# Altium project Beginner_lesson_1.PrjPcb
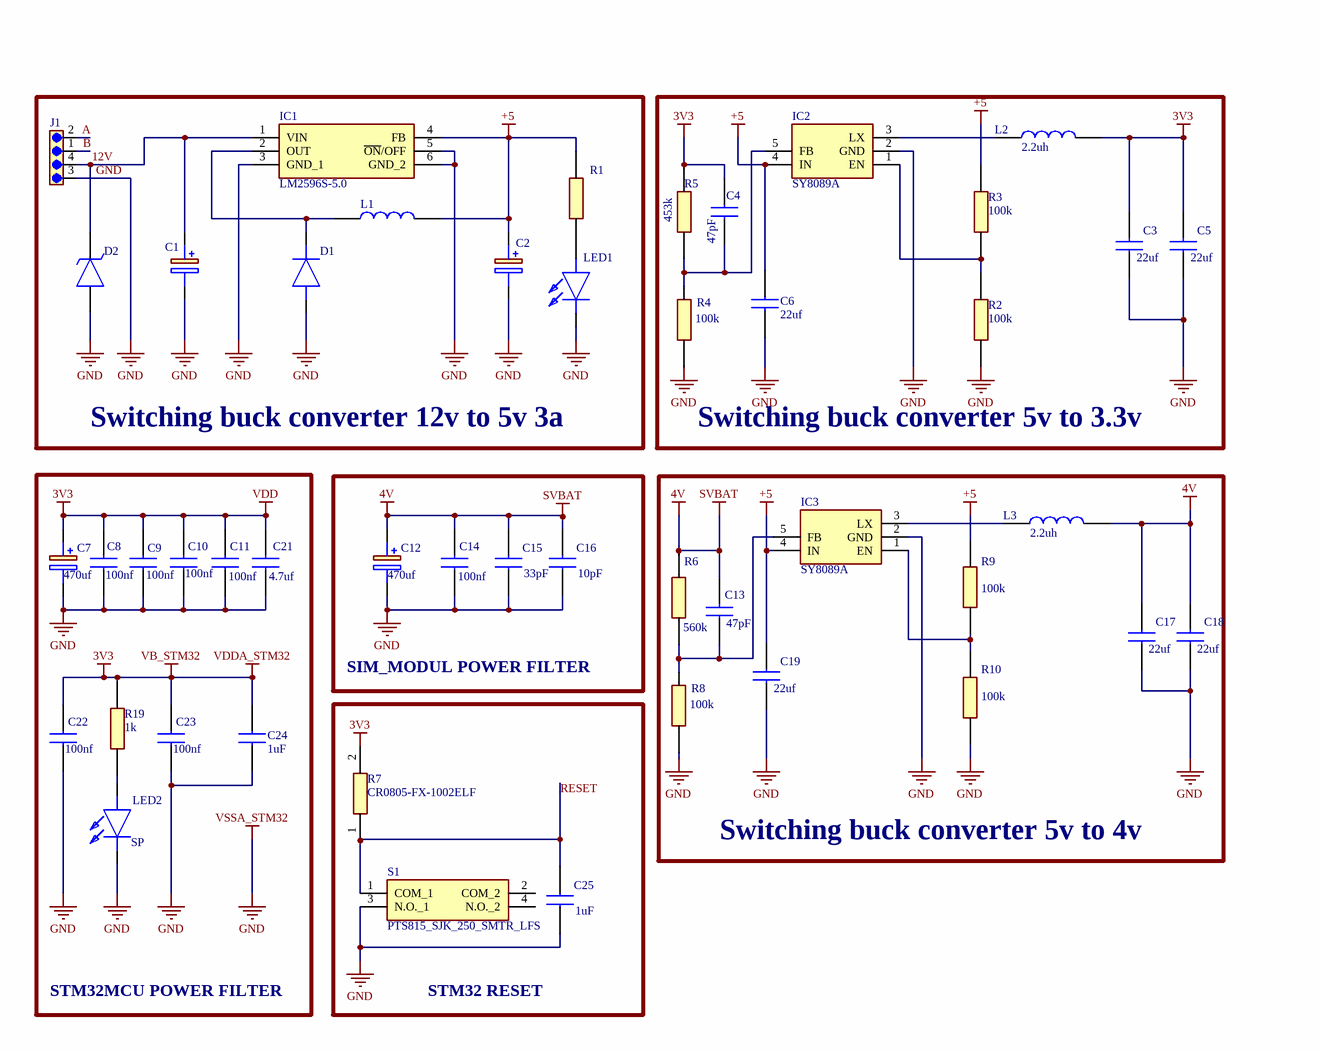
[diagram p0: Schematic.SchDoc, left]
4 sheets, 94 parts. Net scope: global (net labels, ports and power ports of the same name join across sheets).
Board file: PCB_Quectel_M25.PcbDoc
Sheets:
  Schematic.SchDoc
  Sheet1.SchDoc
  Sheet3.SchDoc
  Sheet2.SchDoc

## Sheet Schematic.SchDoc
size A; SheetNumber: 1; SheetTotal: 4

### Parts
C1  B40900B5477M000  [CAPAE1030X1280N]  (value not drawn)
C2  220uf  [CAPPM7344X310N]  (value not drawn)
C3  22uf  [CAPC2012X140N]
C4  47pF  [C0603]
C5  22uf  [CAPC2012X140N]
C6  22uf  [CAPC2012X140N]
C7  470uf  [T495D]
C8  100nf  [CAPC1608X90N]
C9  100nf  [CAPC1608X90N]
C10  100nf  [CAPC1608X90N]
C11  100nf  [CAPC1608X90N]
C12  470uf  [T495D]
C13  47pF  [C0603]
C14  100nf  [CAPC1608X90N]
C15  33pF  [CAPC0603X33N]
C16  10pF  [CAPC1608X90N]
C17  22uf  [CAPC2012X140N]
C18  22uf  [CAPC2012X140N]
C19  22uf  [CAPC2012X140N]
C21  4.7uf  [CAPC2012X152N]
C22  100nf  [CAPC1608X90N]
C23  100nf  [CAPC1608X90N]
C24  1uF  [CAPC1608X90N]
C25  1uF  [CAPC1608X90N]
D1  SS54B  [DIOM5336X244N]  (value not drawn)
D2  ESDA17P50-1U1M  [ESDA17P501U1M]  (value not drawn)
IC1  LM2596S-5.0  [KTT0005B]
IC2  SY8089A  [SOT95P285X140-5N]
IC3  SY8089A  [SOT95P285X140-5N]
J1  691322310004  [691322310004]  (value not drawn)
L1  SRR1260-330M  [SRR1260-150M]  (value not drawn)
L2  2.2uh  [MPLAL50302R2]
L3  2.2uh  [MPLAL50302R2]
LED1  150080GS75000  [LEDM2012X80N]  (value not drawn)
LED2  SP  [LEDC2012X110N]
R1  150R  [RESC2012X65N]  (value not drawn)
R2  100k  [RESC2012X60N]
R3  100k  [RESC2012X60N]
R4  100k  [RESC2012X60N]
R5  453k  [RESC2012X60N]
R6  560k  [RESC2012X65N]
R7  CR0805-FX-1002ELF  [RESC2012X60N]
R8  100k  [RESC2012X60N]
R9  100k  [RESC2012X60N]
R10  100k  [RESC2012X60N]
R19  1k  [RESC1005X40N]
S1  PTS815_SJK_250_SMTR_LFS  [PTS815SJK250SMTRLFS]

### Blocks framed on the sheet
Switching buck converter 12v to 5v 3a: C1 C2 D1 D2 IC1 J1 L1 LED1 R1
Switching buck converter 5v to 3.3v: C3-C6 IC2 L2 R2-R5
STM32MCU POWER FILTER: C7-C11 C21-C24 LED2 R19
SIM_MODUL POWER FILTER: C12 C14-C16
Switching buck converter 5v to 4v: C13 C17-C19 IC3 L3 R6 R8-R10
STM32 RESET: C25 R7 S1

### Nets
4V: C12.1(+) C13.2 C14.2 C15.2 C16.2(C2) C17.2 C18.2 L3.2 R6.2  [also labelled SVBAT]
+5: C2.1(+) C6.2 C19.2 IC1.4(FB) IC2.4(IN) IC3.4(IN) L1.2 R1.2 R3.2 R9.2
GND: C1.2(-) C2.2(-) C3.1 C5.1 C6.1 C7.2(-) C8.1 C9.1 C10.1 C11.1 C12.2(-) C14.1 C15.1 C16.1(C1) C17.1 C18.1 C19.1 C21.1 C22.1 C23.1 C24.1 C25.1 D1.2(A) D2.2(A) IC1.3(GND_1) IC1.5(~{ON}/OFF) IC1.6(GND_2) IC2.2(GND) IC3.2(GND) J1.3 LED1.1(K) LED2.1(K) R2.1 R4.1 R8.1 R10.1 S1.3(N.O._1)  [also labelled VSSA_STM32]
VB_STM32: C3.2 C4.2 C5.2 C7.1(+) C8.2 C9.2 C10.2 C11.2 C21.2 C22.2 C23.2 C24.2 L2.2 R5.2 R7.2 R19.2  [also labelled 3V3, VDD, VDDA_STM32]
12V: C1.1(+) D2.1(K) IC1.1(VIN) J1.4
A: J1.2
B: J1.1
RESET: C25.2 R7.1 S1.1(COM_1)
NetC4_1: C4.1 IC2.5(FB) R4.2 R5.1
NetC13_1: C13.1 IC3.5(FB) R6.1 R8.2
NetD1_1: D1.1(K) IC1.2(OUT) L1.1
NetIC2_1: IC2.1(EN) R2.2 R3.1
NetIC2_3: IC2.3(LX) L2.1
NetIC3_1: IC3.1(EN) R9.1 R10.2
NetIC3_3: IC3.3(LX) L3.1
NetLED1_2: LED1.2(A) R1.1
NetLED2_2: LED2.2(A) R19.1

Not connected (* = marked no-connect by the designer): S1 2(COM_2) 4(N.O._2)

### Library data of the parts
C1 = B40900B5477M000: Capacitor Polarised; Manufacturer_Name: TDK; Datasheet Link: https://product.tdk.com/system/files/dam/doc/product/capacitor/aluminum-electrolytic/hybrid-polymer/data_sheet/20/30/db/aec/b40900.pdf; Height: 12.8mm; Manufacturer_Part_Number: B40900B5477M000; Mouser Part Number: 871-B40900B5477M000; Mouser Price/Stock: https://www.mouser.co.uk/ProductDetail/EPCOS-TDK/B40900B5477M000?qs=sPbYRqrBIVkjJ1xmSzm%2FSw%3D%3D
C2 = TAJD227K010RNJ: Capacitor Polarised 220uf 10v smd tantalum Part Number: TAJD227K010RNJ; Manufacturer_Name: AVX; Datasheet Link: http://datasheets.avx.com/TAJ.pdf; Height: 3.1mm; Manufacturer_Part_Number: TAJD227K010RNJ; Mouser Part Number: 581-TAJD227K010R; Mouser Price/Stock: https://www.mouser.co.uk/ProductDetail/AVX/TAJD227K010RNJ?qs=min0%252Bk%2FlUAadDEgYeVIB%252Bw%3D%3D; Arrow Part Number: TAJD227K010RNJ; Arrow Price/Stock: https://www.arrow.com/en/products/tajd227k010rnj/avx
C3 C5 C6 C17-C19 = CL21X226MQQNNNE: Capacitor; Manufacturer_Name: SAMSUNG; Datasheet Link: https://product.samsungsem.com/part/download.do; Height: 1.4mm; Manufacturer_Part_Number: CL21X226MQQNNNE; Mouser Part Number: N/A; Mouser Price/Stock: https://www.mouser.com/Search/Refine.aspx?Keyword=N%2FA; Arrow Part Number: CL21X226MQQNNNE; Arrow Price/Stock: https://www.arrow.com/en/products/cl21x226mqqnnne/samsung-electro-mechanics
C4 C13 = C0603H470J5GACTU: Capacitor Part Number: C0603H470J5GACTU 47pf 50v 0603; Manufacturer_Name: KEMET; Datasheet Link: https://content.kemet.com/datasheets/KEM_C1001_C0G_200C_SMD.pdf; Height: 0.87mm; Manufacturer_Part_Number: C0603H470J5GACTU; Mouser Part Number: 80-C0603H470J5GACTU; Mouser Price/Stock: https://www.mouser.co.uk/ProductDetail/KEMET/C0603H470J5GACTU?qs=OlC7AqGiEDlBSvW2T4T4RQ%3D%3D
C7 C12 = T495D477K006ATE100: Capacitor Polarised; Manufacturer_Name: KEMET; Datasheet Link: https://content.kemet.com/datasheets/KEM_T2009_T495.pdf; Height: 3.1mm; Manufacturer_Part_Number: T495D477K006ATE100; Mouser Part Number: 80-T495D477K006E100; Mouser Price/Stock: https://www.mouser.co.uk/ProductDetail/KEMET/T495D477K006ATE100?qs=JMiwNnuXh3pQ954ydQHvqQ%3D%3D; Arrow Part Number: T495D477K006ATE100; Arrow Price/Stock: https://www.arrow.com/en/products/t495d477k006ate100/kemet-corporation?region=nac
C8-C11 C14 C22 C23 = 06036C104MAZ2A: Capacitor; Manufacturer_Name: AVX; Datasheet Link: https://componentsearchengine.com/Datasheets/1/06031A100FAT2A.pdf; Height: 0.9mm; Manufacturer_Part_Number: 06036C104MAZ2A; Mouser Part Number: 581-06036C104MAZ2A; Mouser Price/Stock: https://www.mouser.co.uk/ProductDetail/AVX/06036C104MAZ2A?qs=9g9l2Gjnh0s%2FYval7p6%252B1g%3D%3D; Arrow Part Number: 06036C104MAZ2A; Arrow Price/Stock: https://www.arrow.com/en/products/06036c104maz2a/avx
C15 = GJM0335C0J330JB01D: Capacitor; Manufacturer_Name: Murata Electronics; Datasheet Link: https://datasheet.datasheetarchive.com/originals/distributors/Datasheets_SAMA/1b8ebccddda42a85d5d2941bb85cddb2.pdf; Height: 0.33mm; Manufacturer_Part_Number: GJM0335C0J330JB01D; Mouser Part Number: 81-GJM0335C0J330JB1D; Mouser Price/Stock: https://www.mouser.co.uk/ProductDetail/Murata-Electronics/GJM0335C0J330JB01D?qs=563MOeNa05KY2adUKCPfEg%3D%3D; Arrow Part Number: GJM0335C0J330JB01D; Arrow Price/Stock: https://www.arrow.com/en/products/gjm0335c0j330jb01d/murata-manufacturing
C16 = CC0603JRNPO9BN100: Capacitor; Manufacturer_Name: KEMET; Manufacturer_Part_Number: CC0603JRNPO9BN100; Mouser Part Number: 603-C0603JRNPO9BN100; Mouser Price/Stock: https://www.mouser.co.uk/ProductDetail/Yageo/CC0603JRNPO9BN100?qs=vTakOoo5QyIFwFOmdMrXhw%3D%3D; Arrow Part Number: CC0603JRNPO9BN100; Arrow Price/Stock: https://www.arrow.com/en/products/cc0603jrnpo9bn100/yageo
C21 = 08056D475MAT2A: Capacitor; Manufacturer_Name: AVX; Datasheet Link: https://spicat.kyocera-avx.com/product/mlcc/chartview/08056D475MAT2A/DataSheet/X5R; Height: 1.52mm; Manufacturer_Part_Number: 08056D475MAT2A; Mouser Part Number: 581-08056D475M; Mouser Price/Stock: https://www.mouser.com/Search/Refine.aspx?Keyword=581-08056D475M
C24 C25 = 06036C105MAT2A: Capacitor; Manufacturer_Name: AVX; Datasheet Link: https://componentsearchengine.com/Datasheets/1/06031A100FAT2A.pdf; Height: 0.9mm; Manufacturer_Part_Number: 06036C105MAT2A; Mouser Part Number: 581-06036C105MAT2A; Mouser Price/Stock: https://www.mouser.co.uk/ProductDetail/AVX/06036C105MAT2A?qs=1X9trZCrWl0x0jW7AUsrpw%3D%3D; Arrow Part Number: 06036C105MAT2A; Arrow Price/Stock: https://www.arrow.com/en/products/06036c105mat2a/avx
D1 = SS54B: Diode; Manufacturer_Name: HY Electronic; Datasheet Link: https://datasheet.datasheetarchive.com/originals/distributors/Datasheets-3/DSA-43270.pdf; Height: 2.44mm; Manufacturer_Part_Number: SS54B
D2 = ESDA17P50-1U1M: TVS Diode (Uni-directional); Manufacturer_Name: STMicroelectronics; Datasheet Link: http://www.st.com/content/ccc/resource/technical/document/datasheet/group3/21/d7/38/9c/80/7e/49/d0/DM00304840/files/DM00304840.pdf/jcr:content/translations/en.DM00304840.pdf; Height: 0.6mm; Manufacturer_Part_Number: ESDA17P50-1U1M; Mouser Part Number: 511-ESDA17P50-1U1M; Mouser Price/Stock: https://www.mouser.co.uk/ProductDetail/STMicroelectronics/ESDA17P50-1U1M?qs=aVyJF2WnouQ6X0XKPX5Sbg%3D%3D; Arrow Part Number: ESDA17P50-1U1M; Arrow Price/Stock: https://www.arrow.com/en/products/esda17p50-1u1m/stmicroelectronics?region=nac
IC1 = LM2596S-5.0: Integrated Circuit; Manufacturer_Name: Texas Instruments; Datasheet Link: https://www.ti.com/lit/gpn/LM2596; Manufacturer_Part_Number: LM2596S-5.0; Mouser Part Number: 926-LM2596S-50; Mouser Price/Stock: https://www.mouser.co.uk/ProductDetail/Texas-Instruments/LM2596S-5.0?qs=X1J7HmVL2ZGcOr96VNr%252B%2Fw%3D%3D; Arrow Part Number: LM2596S-5.0; Arrow Price/Stock: https://www.arrow.com/en/products/lm2596s-5.0/texas-instruments?region=nac
IC2 IC3 = SY8089A: Integrated Circuit; Manufacturer_Name: Silergy; Datasheet Link: https://datasheet.lcsc.com/szlcsc/SY8089AAAC_C78988.pdf; Height: 1.4mm; Manufacturer_Part_Number: SY8089A
J1 = 691322310004: 4 Position Terminal Block Header, Male Pins, Shrouded (4 Side) 0.150 (3.81mm) 90Â°, Right Angle Through Hole; MF: Wurth Electronics; SnapEDA_Link: https://www.snapeda.com/parts/691322310004/Wurth+Electronics+Inc./view-part/?ref=snap; Package: None; Value: *; MP: 691322310004; Check_prices: https://www.snapeda.com/parts/691322310004/Wurth+Electronics+Inc./view-part/?ref=eda
L1 = SRR1260-330M: Inductor 33uH; Manufacturer_Name: Bourns; Datasheet Link: https://www.bourns.com/docs/Product-Datasheets/SRR1260.pdf; Manufacturer_Part_Number: SRR1260-330M; Mouser Part Number: 652-SRR1260-330M; Mouser Price/Stock: https://www.mouser.co.uk/ProductDetail/Bourns/SRR1260-330M?qs=R2jSSvul3fC3V4%252BTrq0P0w%3D%3D; Arrow Part Number: SRR1260-330M; Arrow Price/Stock: https://www.arrow.com/en/products/srr1260-330m/bourns?region=nac
L2 L3 = MPL-AL5030-2R2: Inductor Part Number :MPL-AL5030-2R2; Manufacturer_Name: Monolithic Power Systems (MPS); Datasheet Link: https://www.monolithicpower.com/en/documentview/productdocument/index/version/2/document_type/Datasheet/lang/en/sku/MPL-AL5030-2R2/document_id/5804; Height: 3.1mm; Manufacturer_Part_Number: MPL-AL5030-2R2; Mouser Part Number: 946-MPL-AL5030-2R2; Mouser Price/Stock: https://www.mouser.co.uk/ProductDetail/Monolithic-Power-Systems-MPS/MPL-AL5030-2R2?qs=sPbYRqrBIVnhOZ%2F5ltO9Lw%3D%3D
LED1 = 150080GS75000: LED; Manufacturer_Name: Wurth Elektronik; Datasheet Link: https://katalog.we-online.com/led/datasheet/150080GS75000.pdf; Height: 0.8mm; Manufacturer_Part_Number: 150080GS75000; Mouser Part Number: 710-150080GS75000; Mouser Price/Stock: https://www.mouser.co.uk/ProductDetail/Wurth-Elektronik/150080GS75000?qs=2kOmHSv6VfQRoTEZVk1mGA%3D%3D
LED2 = SM0805RC: LED; Manufacturer_Name: Bivar; Datasheet Link: https://componentsearchengine.com/Datasheets/1/SM0805RC.pdf; Height: 1.1mm; Manufacturer_Part_Number: SM0805RC; Mouser Part Number: 749-SM0805RC; Mouser Price/Stock: https://www.mouser.co.uk/ProductDetail/Bivar/SM0805RC?qs=jaLxTFIJCivm3JSYe5gHjQ%3D%3D
R1 = RMCF0805FT150R: Resistor 0805 150R 1/4W; Manufacturer_Name: Stackpole Electronics; Datasheet Link: https://cs.seielect.com/catalog/SEI-RMCF_RMCP.pdf; Height: 0.65mm; Manufacturer_Part_Number: RMCF0805FT150R; Mouser Part Number: 708-RMCF0805FT150R; Mouser Price/Stock: https://www.mouser.co.uk/ProductDetail/SEI-Stackpole/RMCF0805FT150R?qs=FESYatJ8odKRN1MTHzs13Q%3D%3D; Arrow Part Number: RMCF0805FT150R; Arrow Price/Stock: https://www.arrow.com/en/products/rmcf0805ft150r/stackpole-electronics?region=nac
R2-R4 R8-R10 = CR0805-FX-1003ELF: Resistor; Manufacturer_Name: Bourns; Datasheet Link: https://www.bourns.com/pdfs/chpreztr.pdf; Height: 0.6mm; Manufacturer_Part_Number: CR0805-FX-1003ELF; Mouser Part Number: 652-CR0805FX-1003ELF; Mouser Price/Stock: https://www.mouser.co.uk/ProductDetail/Bourns/CR0805-FX-1003ELF?qs=tknLyCMIRbPd3RvyRhvkuQ%3D%3D; Arrow Part Number: CR0805-FX-1003ELF; Arrow Price/Stock: https://www.arrow.com/en/products/cr0805-fx-1003elf/bourns?region=nac
R5 = RK73H2ATTD4533F: Resistor 453k 0805 1/4w; Manufacturer_Name: KOA Speer; Datasheet Link: http://www.koaspeer.com/catimages/Products/RK73H/RK73H.pdf; Height: 0.6mm; Manufacturer_Part_Number: RK73H2ATTD4533F; Mouser Part Number: 660-RK73H2ATTD4533F; Mouser Price/Stock: https://www.mouser.com/Search/Refine.aspx?Keyword=660-RK73H2ATTD4533F; Arrow Part Number: RK73H2ATTD4533F; Arrow Price/Stock: https://www.arrow.com/en/products/rk73h2attd4533f/koa-speer-electronics
R6 = CPF0805B560KE: Resistor; Manufacturer_Name: TE Connectivity; Datasheet Link: http://docs-europe.electrocomponents.com/webdocs/13d1/0900766b813d116f.pdf; Height: 0.65mm; Manufacturer_Part_Number: CPF0805B560KE
R7 = CR0805-FX-1002ELF: Resistor; Manufacturer_Name: Bourns; Datasheet Link: https://www.bourns.com/pdfs/chpreztr.pdf; Height: 0.6mm; Manufacturer_Part_Number: CR0805-FX-1002ELF; Mouser Part Number: 652-CR0805FX-1002ELF; Mouser Price/Stock: https://www.mouser.co.uk/ProductDetail/Bourns/CR0805-FX-1002ELF?qs=tknLyCMIRbPr%252BDD0s0nG9g%3D%3D; Arrow Part Number: CR0805-FX-1002ELF; Arrow Price/Stock: https://www.arrow.com/en/products/cr0805-fx-1002elf/bourns?region=nac
R19 = RC0402JR-071KL: Resistor; Manufacturer_Name: KEMET; Datasheet Link: http://www.yageo.com/documents/recent/PYu-RC0402_51_RoHS_L_6_r.pdf; Height: 0.4mm; Manufacturer_Part_Number: RC0402JR-071KL; Mouser Part Number: 603-RC0402JR-071KL; Mouser Price/Stock: https://www.mouser.co.uk/ProductDetail/YAGEO/RC0402JR-071KL?qs=uM1JSSdPjOCtzNbByOhClA%3D%3D; Arrow Part Number: RC0402JR-071KL; Arrow Price/Stock: https://www.arrow.com/en/products/rc0402jr-071kl/yageo?region=europe
S1 = PTS815_SJK_250_SMTR_LFS: Switch; Manufacturer_Name: C & K COMPONENTS; Manufacturer_Part_Number: PTS815 SJK 250 SMTR LFS; Datasheet Link: https://www.mouser.com/datasheet/2/60/pts815-1535658.pdf; Height: 2mm; Mouser Part Number: 611-PTS815SJK250SMTR; Mouser Price/Stock: https://www.mouser.co.uk/ProductDetail/CK/PTS815-SJK-250-SMTR-LFS?qs=ahcBuItHZ3yETpGYMHf%2FgQ%3D%3D; Arrow Part Number: PTS815 SJK 250 SMTR LFS; Arrow Price/Stock: https://www.arrow.com/en/products/pts815-sjk-250-smtr-lfs/ck

## Sheet Sheet1.SchDoc
size A; SheetNumber: 2; SheetTotal: 4
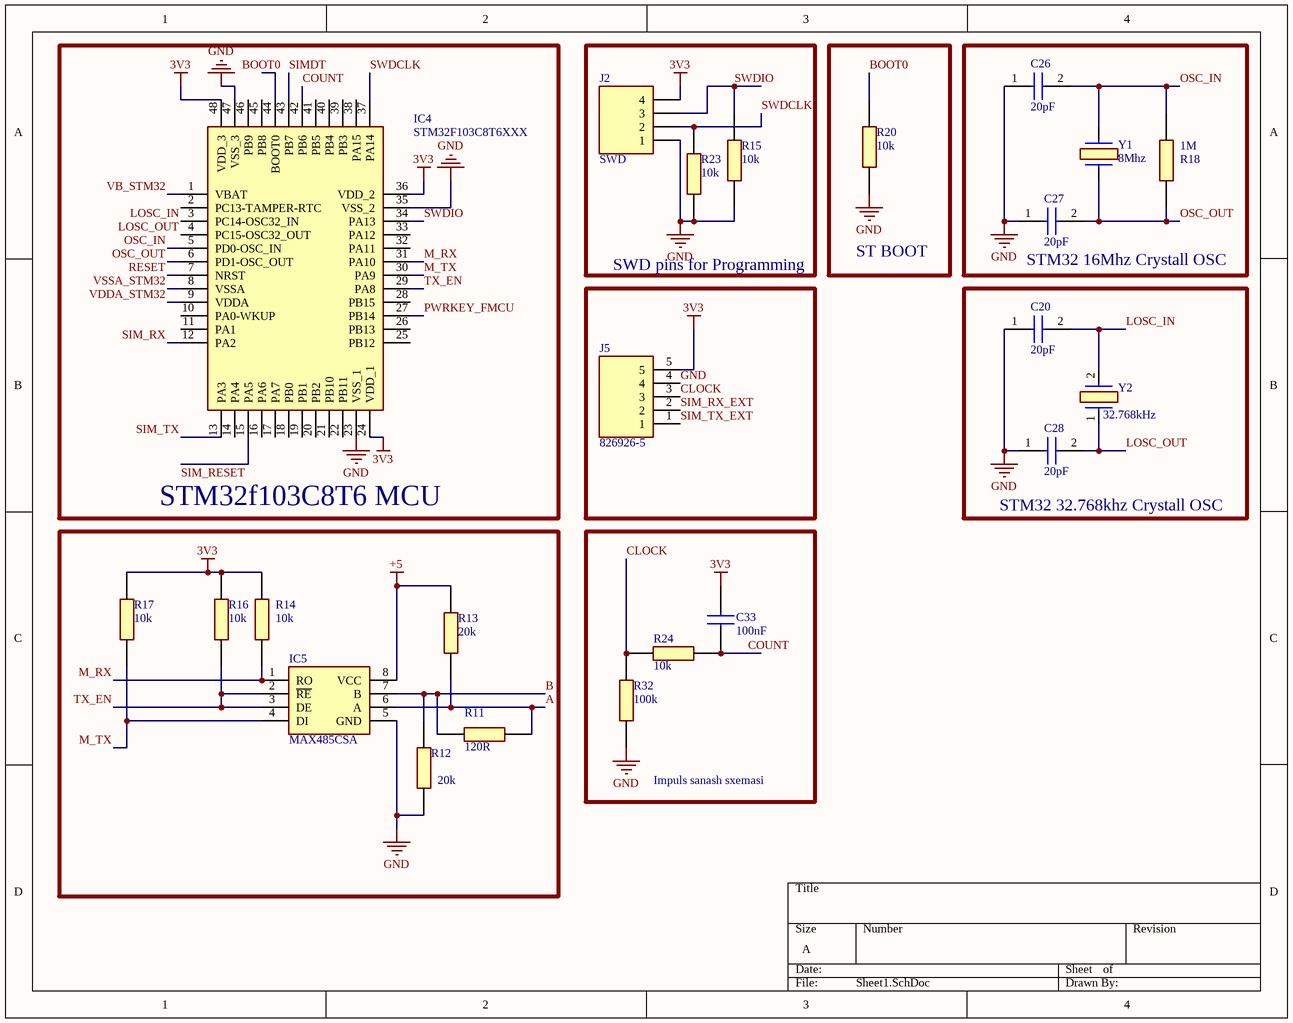
[diagram p1: Sheet1.SchDoc]

### Parts
C20  20pF  [C0603]
C26  20pF  [C0603]
C27  20pF  [C0603]
C28  20pF  [C0603]
C33  100nF  [CAPC1608X90N]
IC4  STM32F103C8T6XXX  [QFP50P900X900X160-48N]
IC5  MAX485CSA  [SOIC127P600X175-8N]
J2  SWD  [9298340704]
J5  826926-5  [HDRV5W85P0X254_1X5_1270X250X950P]
R11  120R  [RESC2012X60N]
R12  20k  [RESC2012X60N]
R13  20k  [RESC2012X60N]
R14  10k  [RESC2012X60N]
R15  10k  [RESC2012X60N]
R16  10k  [RESC2012X60N]
R17  10k  [RESC2012X60N]
R18  1M  [RESC1608X55N]
R20  10k  [RESC2012X60N]
R23  10k  [RESC2012X60N]
R24  10k  [RESC2012X60N]
R32  100k  [RESC2012X60N]
Y1  8Mhz  [830003151]
Y2  32.768kHz  [ABS06]

### Blocks framed on the sheet
SWD pins for Programming: J2 R15 R23
ST BOOT: R20
STM32 16Mhz Crystall OSC: C26 C27 R18 Y1
STM32 32.768khz Crystall OSC: C20 C28 Y2
STM32f103C8T6 MCU: IC5 R11-R14 R16 R17
Impuls sanash sxemasi: C33 R24 R32

### Nets
+5: IC5.8(VCC) R13.2
GND: C20.1 C26.1 C27.1 C28.1 IC4.8(VSSA) IC4.23(VSS_1) IC4.35(VSS_2) IC4.47(VSS_3) IC5.5(GND) J2.1 J5.4 R12.1 R15.1 R20.1 R23.1 R32.1  [also labelled VSSA_STM32]
VB_STM32: C33.2 IC4.1(VBAT) IC4.9(VDDA) IC4.24(VDD_1) IC4.36(VDD_2) IC4.48(VDD_3) J2.4 J5.5 R14.2 R16.2 R17.2  [also labelled 3V3, VDDA_STM32]
A: IC5.6(A) R11.2 R13.1
B: IC5.7(B) R11.1 R12.2
BOOT0: IC4.44(BOOT0) R20.2
CLOCK: J5.3 R24.2 R32.2
COUNT: C33.1 IC4.42(PB6) R24.1
LOSC_IN: C20.2 IC4.3(PC14-OSC32_IN) Y2.2
LOSC_OUT: C28.2 IC4.4(PC15-OSC32_OUT) Y2.1
M_RX: IC4.31(PA10) IC5.1(RO) R14.1
M_TX: IC4.30(PA9) IC5.4(DI) R17.1
OSC_IN: C26.2 IC4.5(PD0-OSC_IN) R18.2 Y1.1
OSC_OUT: C27.2 IC4.6(PD1-OSC_OUT) R18.1 Y1.2
PWRKEY_FMCU: IC4.27(PB14)
RESET: IC4.7(NRST)
SIM_RESET: IC4.15(PA5)
SIM_RX: IC4.12(PA2)
SIM_RX_EXT: J5.2
SIM_TX: IC4.13(PA3)
SIM_TX_EXT: J5.1
SIMDT: IC4.43(PB7)
SWDCLK: IC4.37(PA14) J2.2 R23.2
SWDIO: IC4.34(PA13) J2.3 R15.2
TX_EN: IC4.29(PA8) IC5.2(~{RE}) IC5.3(DE) R16.1

Not connected (* = marked no-connect by the designer): IC4 2(PC13-TAMPER-RTC) 10(PA0-WKUP) 11(PA1) 14(PA4) 16(PA6) 17(PA7) 18(PB0) 19(PB1) 20(PB2) 21(PB10) 22(PB11) 25(PB12) 26(PB13) 28(PB15) 32(PA11) 33(PA12) 38(PA15) 39(PB3) 40(PB4) 41(PB5) 45(PB8) 46(PB9)

### Library data of the parts
C20 C26-C28 = C0603C200G8HACTU: Capacitor; Manufacturer_Name: KEMET; Datasheet Link: https://content.kemet.com/datasheets/KEM_C1007_X8R_ULTRA_150C_SMD.pdf; Height: 0.87mm; Manufacturer_Part_Number: C0603C200G8HACTU; Mouser Part Number: 80-C0603C200G8HACTU; Mouser Price/Stock: https://www.mouser.co.uk/ProductDetail/KEMET/C0603C200G8HACTU?qs=W0yvOO0ixfFF9ypbpYI35Q%3D%3D
C33 = 06036C104MAZ2A: Capacitor; Manufacturer_Name: AVX; Datasheet Link: https://componentsearchengine.com/Datasheets/1/06031A100FAT2A.pdf; Height: 0.9mm; Manufacturer_Part_Number: 06036C104MAZ2A; Mouser Part Number: 581-06036C104MAZ2A; Mouser Price/Stock: https://www.mouser.co.uk/ProductDetail/AVX/06036C104MAZ2A?qs=9g9l2Gjnh0s%2FYval7p6%252B1g%3D%3D; Arrow Part Number: 06036C104MAZ2A; Arrow Price/Stock: https://www.arrow.com/en/products/06036c104maz2a/avx
IC4 = STM32F103C8T6XXX: Integrated Circuit; Manufacturer_Name: ST; Height: 1.6mm; Manufacturer_Part_Number: STM32F103C8T6XXX
IC5 = MAX485CSA: Integrated Circuit; Manufacturer_Name: Analog Devices; Datasheet Link: https://datasheets.maximintegrated.com/en/ds/MAX1487-MAX491.pdf; Height: 1.75mm; Manufacturer_Part_Number: MAX485CSA; Mouser Part Number: N/A; Mouser Price/Stock: https://www.mouser.co.uk/ProductDetail/Maxim-Integrated/MAX485CSA?qs=LHmEVA8xxfbb%2FSUlm%252BHF3Q%3D%3D
J2 = 929834-07-04: Connector; Manufacturer_Name: 3M; Datasheet Link: https://www.mouser.ca/datasheet/2/1/ts0769-35914.pdf; Height: 8.713mm; Manufacturer_Part_Number: 929834-07-04; Mouser Part Number: 517-929834-07-04; Mouser Price/Stock: https://www.mouser.com/Search/Refine.aspx?Keyword=517-929834-07-04
J5 = 826926-5: Connector; Manufacturer_Name: TE Connectivity; Datasheet Link: http://uk.rs-online.com/web/p/products/6695323; Height: 9.5mm; Manufacturer_Part_Number: 826926-5; Mouser Part Number: 571-826926-5; Mouser Price/Stock: https://www.mouser.co.uk/ProductDetail/TE-Connectivity/826926-5?qs=wMzmFFBcbXS4DfsolxXR2g%3D%3D; Arrow Part Number: 826926-5; Arrow Price/Stock: https://www.arrow.com/en/products/826926-5/te-connectivity?region=europe
R11 = CR0805-JW-121ELF: Resistor; Manufacturer_Name: Bourns; Datasheet Link: https://www.bourns.com/pdfs/chpreztr.pdf; Height: 0.6mm; Manufacturer_Part_Number: CR0805-JW-121ELF; Mouser Part Number: 652-CR0805JW-121ELF; Mouser Price/Stock: https://www.mouser.co.uk/ProductDetail/Bourns/CR0805-JW-121ELF?qs=wL7NMIHXUPnmcuStpLOKew%3D%3D; Arrow Part Number: CR0805-JW-121ELF; Arrow Price/Stock: https://www.arrow.com/en/products/cr0805-jw-121elf/bourns?region=nac
R12 R13 = CR0805-FX-2002ELF: Resistor; Manufacturer_Name: Bourns; Datasheet Link: https://www.bourns.com/pdfs/chpreztr.pdf; Height: 0.6mm; Manufacturer_Part_Number: CR0805-FX-2002ELF; Mouser Part Number: 652-CR0805FX-2002ELF; Mouser Price/Stock: https://www.mouser.co.uk/ProductDetail/Bourns/CR0805-FX-2002ELF?qs=mEbcl8R%252Bl%252Bv8rqM1zQjjRA%3D%3D; Arrow Part Number: CR0805-FX-2002ELF; Arrow Price/Stock: https://www.arrow.com/en/products/cr0805-fx-2002elf/bourns?region=nac
R14-R17 R20 R23 R24 = CR0805-FX-1002ELF: Resistor; Manufacturer_Name: Bourns; Datasheet Link: https://www.bourns.com/pdfs/chpreztr.pdf; Height: 0.6mm; Manufacturer_Part_Number: CR0805-FX-1002ELF; Mouser Part Number: 652-CR0805FX-1002ELF; Mouser Price/Stock: https://www.mouser.co.uk/ProductDetail/Bourns/CR0805-FX-1002ELF?qs=tknLyCMIRbPr%252BDD0s0nG9g%3D%3D; Arrow Part Number: CR0805-FX-1002ELF; Arrow Price/Stock: https://www.arrow.com/en/products/cr0805-fx-1002elf/bourns?region=nac
R18 = CR0603-FX-1004ELF: Resistor; Manufacturer_Name: Bourns; Datasheet Link: https://www.bourns.com/pdfs/chpreztr.pdf; Height: 0.55mm; Manufacturer_Part_Number: CR0603-FX-1004ELF; Mouser Part Number: 652-CR0603FX-1004ELF; Mouser Price/Stock: https://www.mouser.co.uk/ProductDetail/Bourns/CR0603-FX-1004ELF?qs=e7cxVwPieuqVG4NBrfqH%252BA%3D%3D; Arrow Part Number: CR0603-FX-1004ELF; Arrow Price/Stock: https://www.arrow.com/en/products/cr0603-fx-1004elf/bourns?region=nac
R32 = CR0805-FX-1003ELF: Resistor; Manufacturer_Name: Bourns; Datasheet Link: https://www.bourns.com/pdfs/chpreztr.pdf; Height: 0.6mm; Manufacturer_Part_Number: CR0805-FX-1003ELF; Mouser Part Number: 652-CR0805FX-1003ELF; Mouser Price/Stock: https://www.mouser.co.uk/ProductDetail/Bourns/CR0805-FX-1003ELF?qs=tknLyCMIRbPd3RvyRhvkuQ%3D%3D; Arrow Part Number: CR0805-FX-1003ELF; Arrow Price/Stock: https://www.arrow.com/en/products/cr0805-fx-1003elf/bourns?region=nac
Y1 = 830003151: Crystal or Oscillator; Manufacturer_Name: Wurth Elektronik; Datasheet Link: https://www.we-online.com/catalog/datasheet/830003151.pdf; Height: 4.3mm; Manufacturer_Part_Number: 830003151; Mouser Part Number: 710-830003151; Mouser Price/Stock: https://www.mouser.co.uk/ProductDetail/Wurth-Elektronik/830003151?qs=2WXlatMagcHisY7XHApyYg%3D%3D
Y2 = ABS06-127-32.768KHZ-T: Crystal or Oscillator; Manufacturer_Name: ABRACON; Datasheet Link: https://abracon.com/Resonators/ABS06.pdf; Height: 0.6mm; Manufacturer_Part_Number: ABS06-127-32.768KHZ-T; Mouser Part Number: 815-ABS0612732.768KT; Mouser Price/Stock: https://www.mouser.co.uk/ProductDetail/ABRACON/ABS06-127-32.768KHZ-T?qs=wUXugUrL1qxIf8zF6vMtIQ%3D%3D; Arrow Part Number: ABS06-127-32.768KHZ-T; Arrow Price/Stock: https://www.arrow.com/en/products/abs06-127-32.768khz-t/abracon?region=nac

## Sheet Sheet3.SchDoc
size A; SheetNumber: 3; SheetTotal: 4
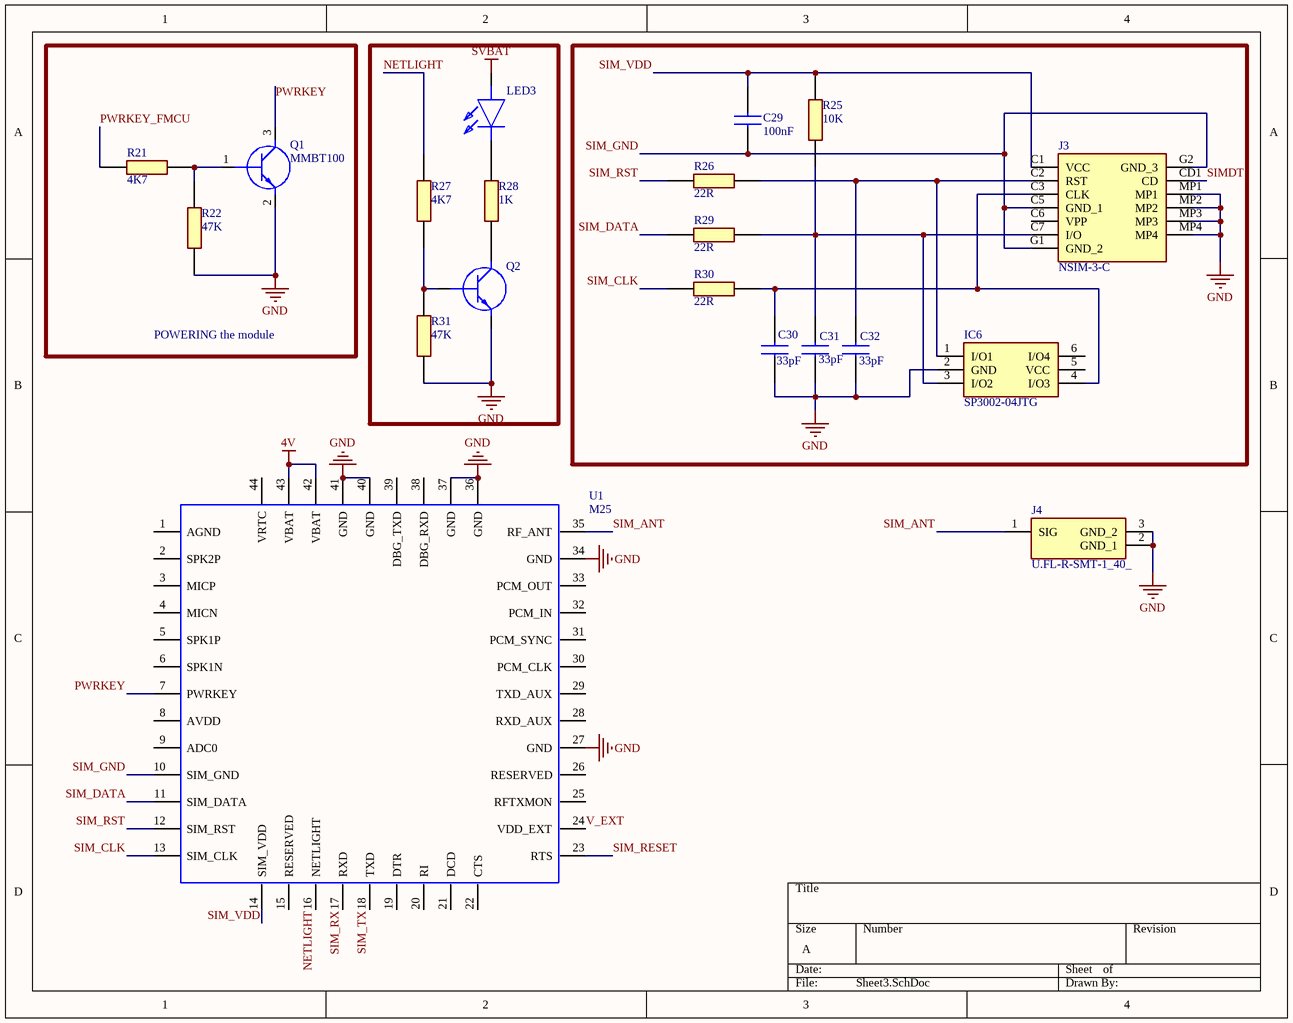
[diagram p2: Sheet3.SchDoc]

### Parts
C29  100nF  [CAPC1608X90N]
C30  33pF  [CAPC0603X33N]
C31  33pF  [CAPC0603X33N]
C32  33pF  [CAPC0603X33N]
IC6  SP3002-04JTG  [SOT65P220X110-6N]
J3  NSIM-3-C  [NSIM3C]
J4  U.FL-R-SMT-1_40_  [UFLRSMT140]
LED3  (no value)  [LEDC1608X80N]
Q1  MMBT100  [SOT96P237X111-3N]
Q2  MMBT100  [SOT96P237X111-3N]  (value not drawn)
R21  4K7  [RESC1608X55N]
R22  47K  [RESC1608X55N]
R25  10K  [RESC2012X60N]
R26  22R  [RESC1608X55N]
R27  4K7  [RESC1608X55N]
R28  1K  [RESC2012X65N]
R29  22R  [RESC1608X55N]
R30  22R  [RESC1608X55N]
R31  47K  [RESC1608X55N]
U1  M25  [PCBComponent_1]

### Blocks framed on the sheet
POWERING the module: Q1 R21 R22

### Nets
4V: LED3.2(A) U1.42(VBAT) U1.43(VBAT)  [also labelled SVBAT]
GND: C30.1 C31.1 C32.1 IC6.2(GND) J3.MP1 J3.MP2 J3.MP3 J3.MP4 J4.2(GND_1) J4.3(GND_2) Q1.2(E) Q2.2(E) R22.1 R31.1 U1.27(GND) U1.34(GND) U1.36(GND) U1.37(GND) U1.40(GND) U1.41(GND)
NETLIGHT: R27.1 U1.16(NETLIGHT)
PWRKEY: Q1.3(C) U1.7(PWRKEY)
PWRKEY_FMCU: R21.1
SIM_ANT: J4.1(SIG) U1.35(RF_ANT)
SIM_CLK: R30.1 U1.13(SIM_CLK)
SIM_DATA: R29.1 U1.11(SIM_DATA)
SIM_GND: C29.1 J3.C5(GND_1) J3.G1(GND_2) J3.G2(GND_3) U1.10(SIM_GND)
SIM_RESET: U1.23(RTS)
SIM_RST: R26.1 U1.12(SIM_RST)
SIM_RX: U1.17(RXD)
SIM_TX: U1.18(TXD)
SIM_VDD: C29.2 J3.C1(VCC) R25.2 U1.14(SIM_VDD)
SIMDT: J3.CD1(CD)
V_EXT: U1.24(VDD_EXT)
NetC30_2: C30.2 IC6.4(I/O3) J3.C3(CLK) R30.2
NetC31_2: C31.2 IC6.3(I/O2) J3.C7(I/O) R25.1 R29.2
NetC32_2: C32.2 IC6.1(I/O1) J3.C2(RST) R26.2
NetLED3_1: LED3.1(K) R28.2
NetQ1_1: Q1.1(B) R21.2 R22.2
NetQ2_1: Q2.1(B) R27.2 R31.2
NetQ2_3: Q2.3(C) R28.1

Not connected (* = marked no-connect by the designer): IC6 5(VCC) 6(I/O4); J3 C6(VPP); U1 1(AGND) 2(SPK2P) 3(MICP) 4(MICN) 5(SPK1P) 6(SPK1N) 8(AVDD) 9(ADC0) 15(RESERVED) 19(DTR) 20(RI) 21(DCD) 22(CTS) 25(RFTXMON) 26(RESERVED) 28(RXD_AUX) 29(TXD_AUX) 30(PCM_CLK) 31(PCM_SYNC) 32(PCM_IN) 33(PCM_OUT) 38(DBG_RXD) 39(DBG_TXD) 44(VRTC)

### Library data of the parts
C29 = 06036C104MAZ2A: Capacitor; Manufacturer_Name: AVX; Datasheet Link: https://componentsearchengine.com/Datasheets/1/06031A100FAT2A.pdf; Height: 0.9mm; Manufacturer_Part_Number: 06036C104MAZ2A; Mouser Part Number: 581-06036C104MAZ2A; Mouser Price/Stock: https://www.mouser.co.uk/ProductDetail/AVX/06036C104MAZ2A?qs=9g9l2Gjnh0s%2FYval7p6%252B1g%3D%3D; Arrow Part Number: 06036C104MAZ2A; Arrow Price/Stock: https://www.arrow.com/en/products/06036c104maz2a/avx
C30-C32 = GJM0335C0J330JB01D: as C15 on sheet Schematic; Datasheet Link: https://datasheet.datasheetarchive.com/originals/distributors/Datasheets_SAMA/1b8ebccddda42a85d5d2941bb85cddb2.pdf; Height: 0.33mm; Manufacturer_Part_Number: GJM0335C0J330JB01D; Mouser Part Number: 81-GJM0335C0J330JB1D; Mouser Price/Stock: https://www.mouser.co.uk/ProductDetail/Murata-Electronics/GJM0335C0J330JB01D?qs=563MOeNa05KY2adUKCPfEg%3D%3D; Arrow Part Number: GJM0335C0J330JB01D; Arrow Price/Stock: https://www.arrow.com/en/products/gjm0335c0j330jb01d/murata-manufacturing
IC6 = SP3002-04JTG: Integrated Circuit; Manufacturer_Name: LITTELFUSE; Datasheet Link: https://m.littelfuse.com/~/media/electronics/datasheets/tvs_diode_arrays/littelfuse_tvs_diode_array_sp3002_datasheet.pdf.pdf; Height: 1.1mm; Manufacturer_Part_Number: SP3002-04JTG; Mouser Part Number: 576-SP3002-04JTG; Mouser Price/Stock: https://www.mouser.co.uk/ProductDetail/Littelfuse/SP3002-04JTG?qs=Xb8IjHhkxj40Q3K%2Fx81Vbw%3D%3D; Arrow Part Number: SP3002-04JTG; Arrow Price/Stock: https://www.arrow.com/en/products/sp3002-04jtg/littelfuse?region=nac
J3 = NSIM-3-C: Connector; Manufacturer_Name: CUI Devices; Datasheet Link: https://www.cuidevices.com/product/resource/pdf/nsim-3-c.pdf; Height: 1.6mm; Manufacturer_Part_Number: NSIM-3-C; Mouser Part Number: 179-NSIM-3-C; Mouser Price/Stock: https://www.mouser.co.uk/ProductDetail/CUI-Devices/NSIM-3-C?qs=Z%252BL2brAPG1Ij16zaFFJpag%3D%3D
J4 = U.FL-R-SMT-1_40_: RF Connectors / Coaxial Connectors SMT MALE RECEPT AU 50 OHM; Manufacturer_Name: Hirose; Manufacturer_Part_Number: U.FL-R-SMT-1(40); Geometry.Height: 1.45mm; Mouser Part Number: 798-UFLRSMT140; Mouser Price/Stock: https://www.mouser.co.uk/ProductDetail/Hirose-Connector/U.FL-R-SMT-140?qs=PABxe4V6HDrVNWAmh6WKgw%3D%3D; Datasheet Link: https://www.arrow.com/en/products/u.fl-r-smt-1-40/hirose-electric
LED3 = 150060YS75000: LED; Manufacturer_Name: Wurth Elektronik; Datasheet Link: http://uk.rs-online.com/web/p/products/8154219; Height: 0.8mm; Manufacturer_Part_Number: 150060YS75000; Mouser Part Number: 710-150060YS75000; Mouser Price/Stock: https://www.mouser.co.uk/ProductDetail/Wurth-Elektronik/150060YS75000?qs=LlUlMxKIyB0nKmwefHgtZw%3D%3D
Q1 Q2 = MMBT100: Transistor BJT NPN; Manufacturer_Name: onsemi; Datasheet Link: https://www.onsemi.com/pub/Collateral/PN100A-D.pdf; Height: 1.11mm; Manufacturer_Part_Number: MMBT100; Mouser Part Number: 512-MMBT100; Mouser Price/Stock: https://www.mouser.co.uk/ProductDetail/onsemi-Fairchild/MMBT100?qs=UMEuL5FsraBwiKQ1WMrjpg%3D%3D; Arrow Part Number: MMBT100; Arrow Price/Stock: https://www.arrow.com/en/products/mmbt100/on-semiconductor?region=nac
R21 R27 = RC0603FR-074K7L: Resistor; Manufacturer_Name: KEMET; Datasheet Link: http://www.yageo.com/documents/recent/PYu-RC0603_51_RoHS_L_v5.pdf; Height: 0.55mm; Manufacturer_Part_Number: RC0603FR-074K7L; Mouser Part Number: 603-RC0603FR-074K7L; Mouser Price/Stock: https://www.mouser.co.uk/ProductDetail/YAGEO/RC0603FR-074K7L?qs=gt6vzsuosg37y0l7Vt36bQ%3D%3D; Arrow Part Number: RC0603FR-074K7L; Arrow Price/Stock: https://www.arrow.com/en/products/rc0603fr-074k7l/yageo?region=europe
R22 R31 = CPF0603B47K5E1: Resistor; Manufacturer_Name: TE Connectivity; Datasheet Link: http://www.farnell.com/datasheets/1786775.pdf; Height: 0.55mm; Manufacturer_Part_Number: CPF0603B47K5E1; Mouser Part Number: 279-CPF0603B47K5E1; Mouser Price/Stock: https://www.mouser.co.uk/ProductDetail/TE-Connectivity-Holsworthy/CPF0603B47K5E1?qs=HLeXuo0aL2pkn%2F2uGrcY6w%3D%3D
R25 = CR0805-FX-1002ELF: Resistor; Manufacturer_Name: Bourns; Datasheet Link: https://www.bourns.com/pdfs/chpreztr.pdf; Height: 0.6mm; Manufacturer_Part_Number: CR0805-FX-1002ELF; Mouser Part Number: 652-CR0805FX-1002ELF; Mouser Price/Stock: https://www.mouser.co.uk/ProductDetail/Bourns/CR0805-FX-1002ELF?qs=tknLyCMIRbPr%252BDD0s0nG9g%3D%3D; Arrow Part Number: CR0805-FX-1002ELF; Arrow Price/Stock: https://www.arrow.com/en/products/cr0805-fx-1002elf/bourns?region=nac
R26 R29 R30 = RC0603FR-0722RL: Resistor; Manufacturer_Name: KEMET; Datasheet Link: http://www.yageo.com/documents/recent/PYu-RC0603_51_RoHS_L_v5.pdf; Height: 0.55mm; Manufacturer_Part_Number: RC0603FR-0722RL; Mouser Part Number: 603-RC0603FR-0722RL; Mouser Price/Stock: https://www.mouser.co.uk/ProductDetail/YAGEO/RC0603FR-0722RL?qs=diQw95jMAeMOsxb8bne7fg%3D%3D
R28 = ACPP0805_1K_B: Resistor; Manufacturer_Name: Ohmite; Manufacturer_Part_Number: ACPP0805 1K B; Datasheet Link: http://www.ohmite.com/assets/docs/acl_acpp.pdf?r=false; Height: 0.65mm; Mouser Part Number: 284-ACPP08051KB; Mouser Price/Stock: https://www.mouser.co.uk/ProductDetail/Ohmite/ACPP0805-1K-B?qs=Zd7iEDjwU0pWc8Q5DTRspw%3D%3D
U1 = M25: Part Description: *; Value: *; Geometry.Height: *; Manufacturer: *; BOMRemark: *; option: *; Part Number: *; PCB DECAL: *

## Sheet Sheet2.SchDoc
size A; SheetNumber: 4; SheetTotal: 4
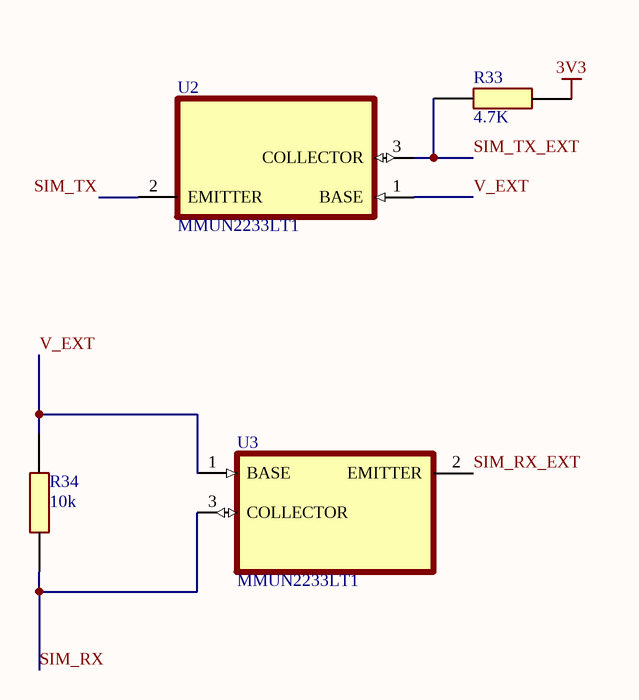
[diagram p3: Sheet2.SchDoc]

### Parts
R33  4.7K  [RESC1608X55N]
R34  10k  [RESC2012X60N]
U2  MMUN2233LT1  [SOT95P237X111-3N]
U3  MMUN2233LT1  [SOT95P237X111-3N]

### Nets
3V3: R33.2  [project net VB_STM32]
SIM_RX: R34.1 U3.3(COLLECTOR)
SIM_RX_EXT: U3.2(EMITTER)
SIM_TX: U2.2(EMITTER)
SIM_TX_EXT: R33.1 U2.3(COLLECTOR)
V_EXT: R34.2 U2.1(BASE) U3.1(BASE)

### Library data of the parts
R33 = RC0603FR-074K7L: Resistor; Manufacturer_Name: KEMET; Datasheet Link: http://www.yageo.com/documents/recent/PYu-RC0603_51_RoHS_L_v5.pdf; Height: 0.55mm; Manufacturer_Part_Number: RC0603FR-074K7L; Mouser Part Number: 603-RC0603FR-074K7L; Mouser Price/Stock: https://www.mouser.co.uk/ProductDetail/YAGEO/RC0603FR-074K7L?qs=gt6vzsuosg37y0l7Vt36bQ%3D%3D; Arrow Part Number: RC0603FR-074K7L; Arrow Price/Stock: https://www.arrow.com/en/products/rc0603fr-074k7l/yageo?region=europe
R34 = CR0805-FX-1002ELF: Resistor; Manufacturer_Name: Bourns; Datasheet Link: https://www.bourns.com/pdfs/chpreztr.pdf; Height: 0.6mm; Manufacturer_Part_Number: CR0805-FX-1002ELF; Mouser Part Number: 652-CR0805FX-1002ELF; Mouser Price/Stock: https://www.mouser.co.uk/ProductDetail/Bourns/CR0805-FX-1002ELF?qs=tknLyCMIRbPr%252BDD0s0nG9g%3D%3D; Arrow Part Number: CR0805-FX-1002ELF; Arrow Price/Stock: https://www.arrow.com/en/products/cr0805-fx-1002elf/bourns?region=nac
U2 U3 = MMUN2233LT1: Pre-Biased Bipolar Transistor (BJT) NPN - Pre-Biased 50V 100mA 246mW Surface Mount SOT-23-3 (TO-236); MF: ON Semiconductor; SnapEDA_Link: https://www.snapeda.com/parts/MMUN2233LT1/Onsemi/view-part/?ref=snap; Package: SOT-23-3 ON Semiconductor; Value: *; MP: MMUN2233LT1; Check_prices: https://www.snapeda.com/parts/MMUN2233LT1/Onsemi/view-part/?ref=eda

## Nets that join several sheets
4V: Schematic (9 pins), Sheet3 (LED3.2 U1.42 U1.43)
+5: Schematic (10 pins), Sheet1 (IC5.8 R13.2)
GND: Schematic (37 pins), Sheet1 (16 pins), Sheet3 (20 pins)
VB_STM32: Schematic (16 pins), Sheet1 (11 pins), Sheet2 (R33.2)
A: Schematic (J1.2), Sheet1 (IC5.6 R11.2 R13.1)
B: Schematic (J1.1), Sheet1 (IC5.7 R11.1 R12.2)
PWRKEY_FMCU: Sheet1 (IC4.27), Sheet3 (R21.1)
RESET: Schematic (C25.2 R7.1 S1.1), Sheet1 (IC4.7)
SIM_RESET: Sheet1 (IC4.15), Sheet3 (U1.23)
SIM_RX: Sheet1 (IC4.12), Sheet3 (U1.17), Sheet2 (R34.1 U3.3)
SIM_RX_EXT: Sheet1 (J5.2), Sheet2 (U3.2)
SIM_TX: Sheet1 (IC4.13), Sheet3 (U1.18), Sheet2 (U2.2)
SIM_TX_EXT: Sheet1 (J5.1), Sheet2 (R33.1 U2.3)
SIMDT: Sheet1 (IC4.43), Sheet3 (J3.CD1)
V_EXT: Sheet3 (U1.24), Sheet2 (R34.2 U2.1 U3.1)